# Altium project RSSI_Tag.PrjPcb
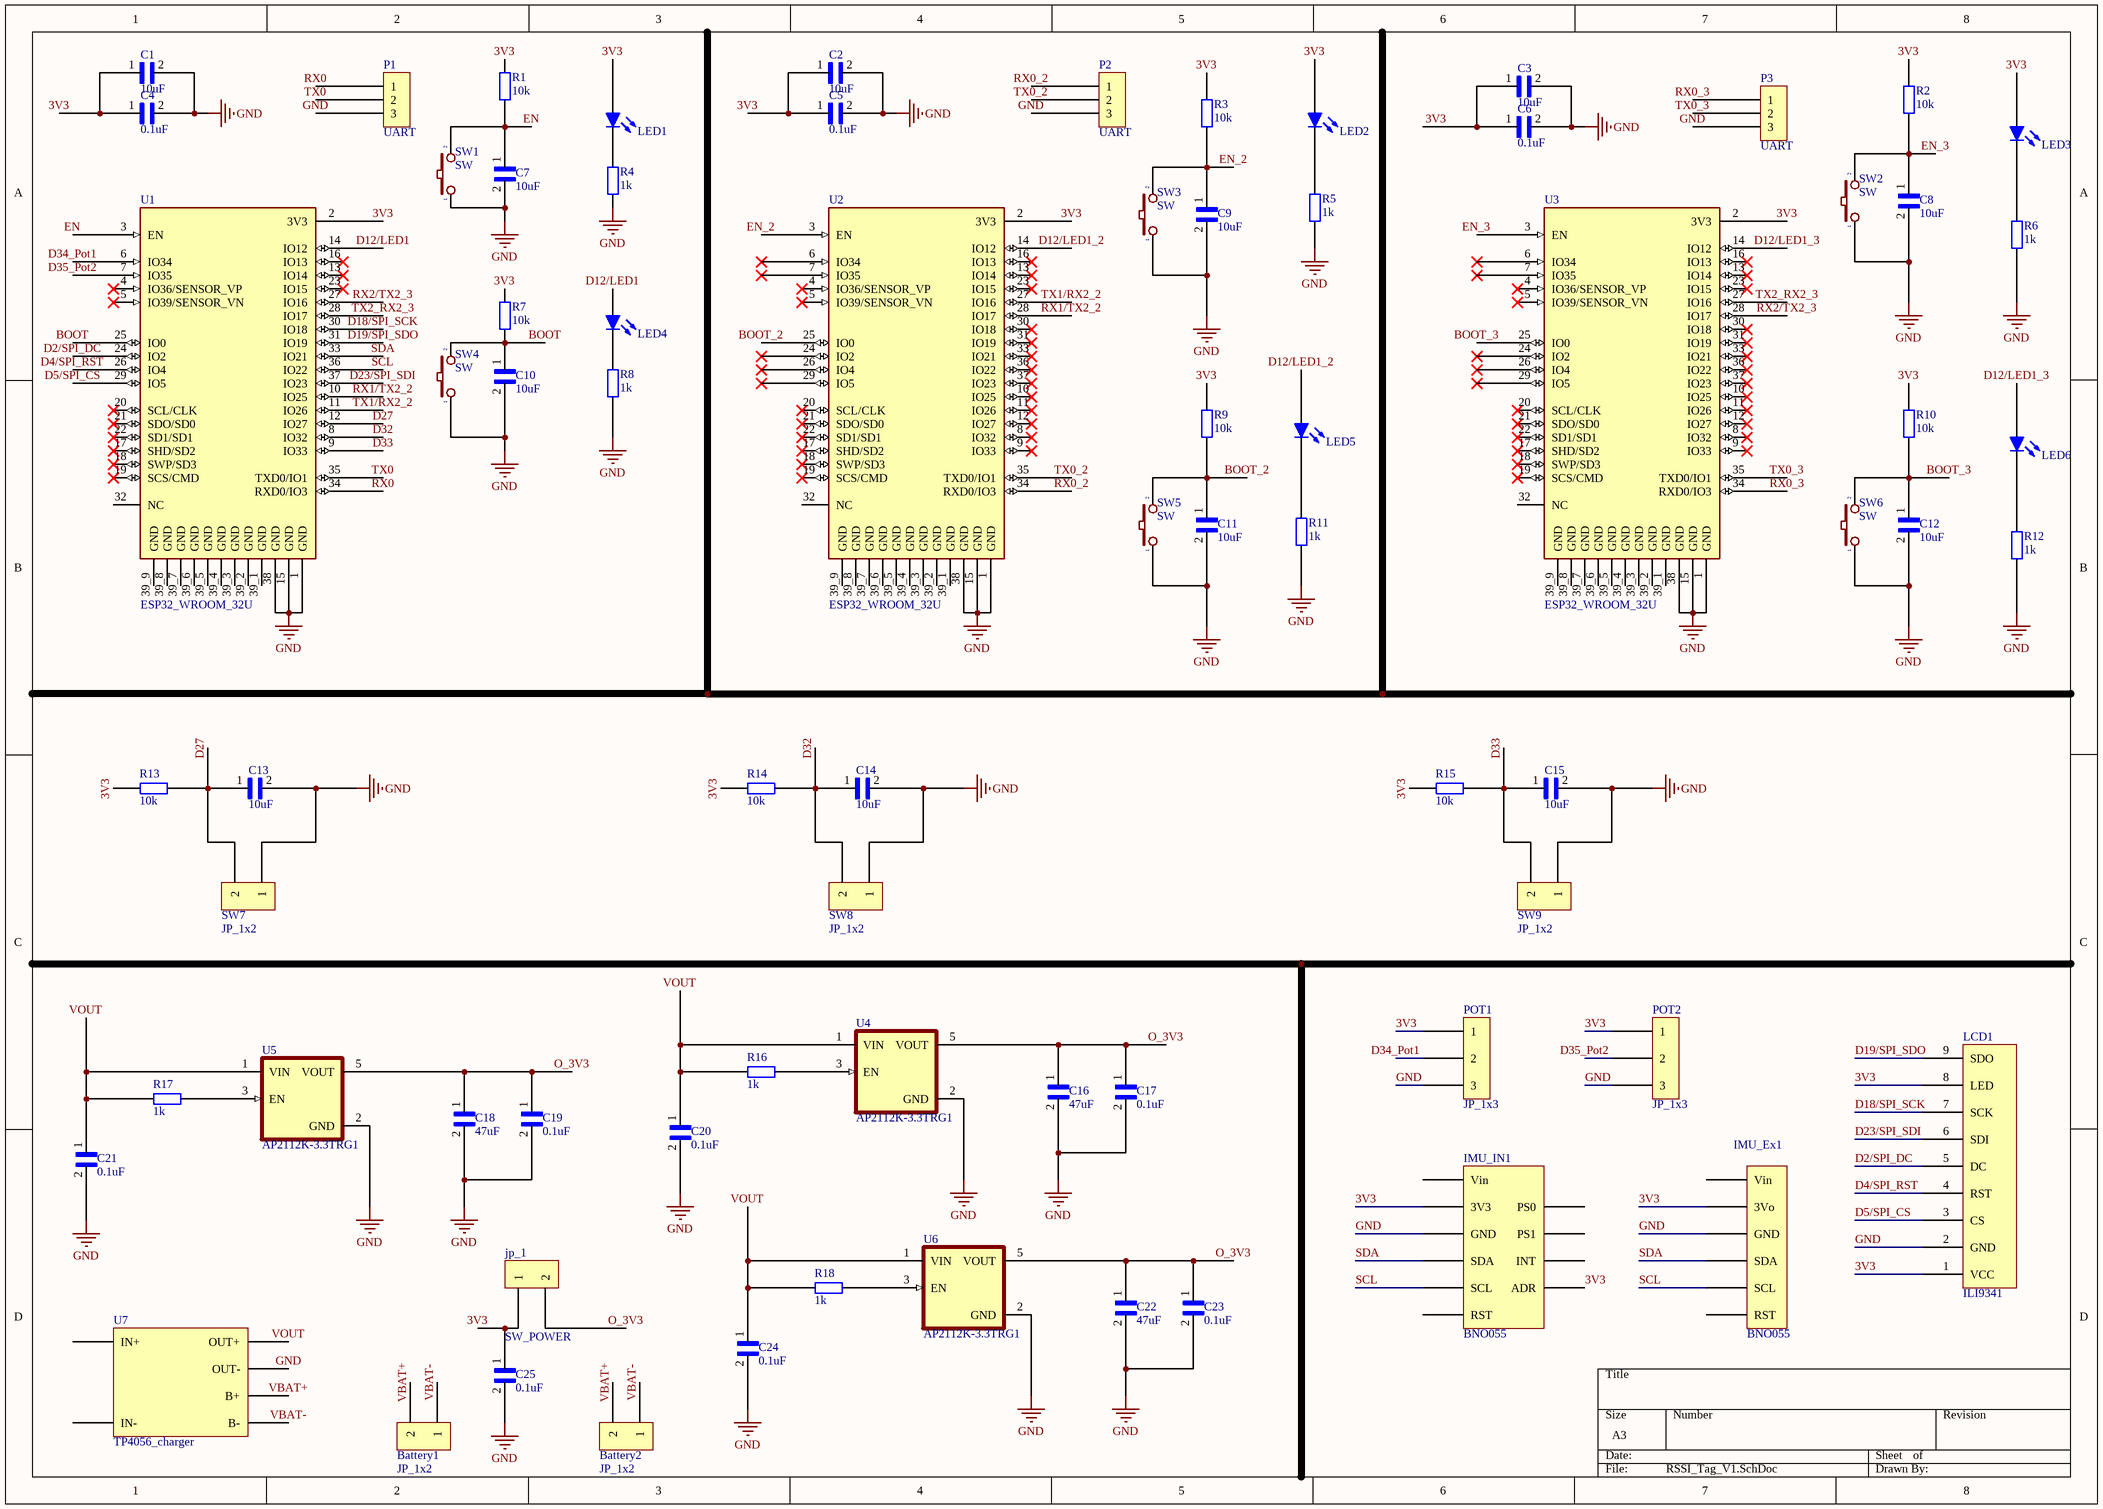
[diagram p0: RSSI_Tag_V1.SchDoc]
1 sheet, 76 parts. Net scope: global (net labels, ports and power ports of the same name join across sheets).
Board file: RSSI_Tag_V1.PcbDoc

## Sheet RSSI_Tag_V1.SchDoc
size A3; SheetNumber: 1; SheetTotal: 1

### Parts
Battery1  JP_1x2  [JP_1x2]
Battery2  JP_1x2  [JP_1x2]
C1  10uF  [Capacitor_0805]
C2  10uF  [Capacitor_0805]
C3  10uF  [Capacitor_0805]
C4  0.1uF  [Capacitor_0805]
C5  0.1uF  [Capacitor_0805]
C6  0.1uF  [Capacitor_0805]
C7  10uF  [Capacitor_0805]
C8  10uF  [Capacitor_0805]
C9  10uF  [Capacitor_0805]
C10  10uF  [Capacitor_0805]
C11  10uF  [Capacitor_0805]
C12  10uF  [Capacitor_0805]
C13  10uF  [Capacitor_0805]
C14  10uF  [Capacitor_0805]
C15  10uF  [Capacitor_0805]
C16  47uF  [Capacitor_0805]
C17  0.1uF  [Capacitor_0805]
C18  47uF  [Capacitor_0805]
C19  0.1uF  [Capacitor_0805]
C20  0.1uF  [Capacitor_0805]
C21  0.1uF  [Capacitor_0805]
C22  47uF  [Capacitor_0805]
C23  0.1uF  [Capacitor_0805]
C24  0.1uF  [Capacitor_0805]
C25  0.1uF  [Capacitor_0805]
IMU_Ex1  BNO055  [BNO055_External]
IMU_IN1  BNO055  [BNO055_Internal]
jp_1  SW_POWER  [JP_1x2]
LCD1  ILI9341  [ILI9341_LCD3.5]
LED1  Led  [Led 0805 Blue]  (value not drawn)
LED2  Led  [Led 0805 Blue]  (value not drawn)
LED3  Led  [Led 0805 Blue]  (value not drawn)
LED4  Led  [Led 0805 Blue]  (value not drawn)
LED5  Led  [Led 0805 Blue]  (value not drawn)
LED6  Led  [Led 0805 Blue]  (value not drawn)
P1  UART  [HDR/Header/3/BOX]
P2  UART  [HDR/Header/3/BOX]
P3  UART  [HDR/Header/3/BOX]
POT1  JP_1x3  [JP_1x3]
POT2  JP_1x3  [JP_1x3]
R1  10k  [tro smd 0805]
R2  10k  [tro smd 0805]
R3  10k  [tro smd 0805]
R4  1k  [tro smd 0805]
R5  1k  [tro smd 0805]
R6  1k  [tro smd 0805]
R7  10k  [tro smd 0805]
R8  1k  [tro smd 0805]
R9  10k  [tro smd 0805]
R10  10k  [tro smd 0805]
R11  1k  [tro smd 0805]
R12  1k  [tro smd 0805]
R13  10k  [tro smd 0805]
R14  10k  [tro smd 0805]
R15  10k  [tro smd 0805]
R16  1k  [tro smd 0805]
R17  1k  [tro smd 0805]
R18  1k  [tro smd 0805]
SW1  SW  [SW1-SMD]
SW2  SW  [SW1-SMD]
SW3  SW  [SW1-SMD]
SW4  SW  [SW1-SMD]
SW5  SW  [SW1-SMD]
SW6  SW  [SW1-SMD]
SW7  JP_1x2  [JP_1x2]
SW8  JP_1x2  [JP_1x2]
SW9  JP_1x2  [JP_1x2]
U1  ESP32_WROOM_32U  [ESP32_WROOM_32U]
U2  ESP32_WROOM_32U  [ESP32_WROOM_32U]
U3  ESP32_WROOM_32U  [ESP32_WROOM_32U]
U4  AP2112K-3.3TRG1  [SOT95P285X140-5N]
U5  AP2112K-3.3TRG1  [SOT95P285X140-5N]
U6  AP2112K-3.3TRG1  [SOT95P285X140-5N]
U7  TP4056_charger  [TP4056_charger]

### Nets
GND: C1.2 C2.2 C3.2 C4.2 C5.2 C6.2 C7.2 C8.2 C9.2 C10.2 C11.2 C12.2 C13.2 C14.2 C15.2 C16.2 C17.2 C18.2 C19.2 C20.2 C21.2 C22.2 C23.2 C24.2 C25.2 IMU_Ex1.3(GND) IMU_IN1.3(GND) LCD1.2(GND) P1.3 P2.3 P3.3 POT1.3 POT2.3 R4.2 R5.2 R6.2 R8.2 R11.2 R12.2 SW1.1 SW2.1 SW3.1 SW4.1 SW5.1 SW6.1 SW7.1 SW8.1 SW9.1 U1.1(GND) U1.15(GND) U1.38(GND) U2.1(GND) U2.15(GND) U2.38(GND) U3.1(GND) U3.15(GND) U3.38(GND) U4.2(GND) U5.2(GND) U6.2(GND) U7.4(OUT-)
3V3: C1.1 C2.1 C3.1 C4.1 C5.1 C6.1 C25.1 IMU_Ex1.2(3Vo) IMU_IN1.2(3V3) IMU_IN1.7(ADR) jp_1.1 LCD1.1(VCC) LCD1.8(LED) LED1.1(A) LED2.1(A) LED3.1(A) POT1.1 POT2.1 R1.2 R2.2 R3.2 R7.2 R9.2 R10.2 R13.2 R14.2 R15.2 U1.2(3V3) U2.2(3V3) U3.2(3V3)
BOOT: C10.1 R7.1 SW4.2 U1.25(IO0)
BOOT_2: C11.1 R9.1 SW5.2 U2.25(IO0)
BOOT_3: C12.1 R10.1 SW6.2 U3.25(IO0)
D2/SPI_DC: LCD1.5(DC) U1.24(IO2)
D4/SPI_RST: LCD1.4(RST) U1.26(IO4)
D5/SPI_CS: LCD1.3(CS) U1.29(IO5)
D12/LED1: LED4.1(A) U1.14(IO12)
D12/LED1_2: LED5.1(A) U2.14(IO12)
D12/LED1_3: LED6.1(A) U3.14(IO12)
D18/SPI_SCK: LCD1.7(SCK) U1.30(IO18)
D19/SPI_SDO: LCD1.9(SDO) U1.31(IO19)
D23/SPI_SDI: LCD1.6(SDI) U1.37(IO23)
D27: C13.1 R13.1 SW7.2 U1.12(IO27)
D32: C14.1 R14.1 SW8.2 U1.8(IO32)
D33: C15.1 R15.1 SW9.2 U1.9(IO33)
D34_Pot1: POT1.2 U1.6(IO34)
D35_Pot2: POT2.2 U1.7(IO35)
EN: C7.1 R1.1 SW1.2 U1.3(EN)
EN_2: C9.1 R3.1 SW3.2 U2.3(EN)
EN_3: C8.1 R2.1 SW2.2 U3.3(EN)
O_3V3: C16.1 C17.1 C18.1 C19.1 C22.1 C23.1 jp_1.2 U4.5(VOUT) U5.5(VOUT) U6.5(VOUT)
RX0: P1.1 U1.34(RXD0/IO3)
RX0_2: P2.1 U2.34(RXD0/IO3)
RX0_3: P3.1 U3.34(RXD0/IO3)
RX1/TX2_2: U1.10(IO25) U2.28(IO17)
RX2/TX2_3: U1.27(IO16) U3.28(IO17)
SCL: IMU_Ex1.5(SCL) IMU_IN1.5(SCL) U1.36(IO22)
SDA: IMU_Ex1.4(SDA) IMU_IN1.4(SDA) U1.33(IO21)
TX0: P1.2 U1.35(TXD0/IO1)
TX0_2: P2.2 U2.35(TXD0/IO1)
TX0_3: P3.2 U3.35(TXD0/IO1)
TX1/RX2_2: U1.11(IO26) U2.27(IO16)
TX2_RX2_3: U1.28(IO17) U3.27(IO16)
VBAT+: Battery1.2 Battery2.2 U7.1(B+)
VBAT-: Battery1.1 Battery2.1 U7.2(B-)
VOUT: C20.1 C21.1 C24.1 R16.1 R17.1 R18.1 U4.1(VIN) U5.1(VIN) U6.1(VIN) U7.3(OUT+)
NetLED1_2: LED1.2(K) R4.1
NetLED2_2: LED2.2(K) R5.1
NetLED3_2: LED3.2(K) R6.1
NetLED4_2: LED4.2(K) R8.1
NetLED5_2: LED5.2(K) R11.1
NetLED6_2: LED6.2(K) R12.1
NetR16_2: R16.2 U4.3(EN)
NetR17_2: R17.2 U5.3(EN)
NetR18_2: R18.2 U6.3(EN)

Not connected (* = marked no-connect by the designer): IMU_Ex1 1(Vin) 6(RST); IMU_IN1 1(Vin) 6(RST) 8(INT) 9(PS1) 10(PS0); U1 4(IO36/SENSOR_VP)* 5(IO39/SENSOR_VN)* 13(IO14)* 16(IO13)* 17(SHD/SD2)* 18(SWP/SD3)* 19(SCS/CMD)* 20(SCL/CLK)* 21(SDO/SD0)* 22(SD1/SD1)* 23(IO15)* 32(NC) 39_1(GND) 39_2(GND) 39_3(GND) 39_4(GND) 39_5(GND) 39_6(GND) 39_7(GND) 39_8(GND) 39_9(GND); U2 4(IO36/SENSOR_VP)* 5(IO39/SENSOR_VN)* 6(IO34)* 7(IO35)* 8(IO32)* 9(IO33)* 10(IO25)* 11(IO26)* 12(IO27)* 13(IO14)* 16(IO13)* 17(SHD/SD2)* 18(SWP/SD3)* 19(SCS/CMD)* 20(SCL/CLK)* 21(SDO/SD0)* 22(SD1/SD1)* 23(IO15)* 24(IO2)* 26(IO4)* 29(IO5)* 30(IO18)* 31(IO19)* 32(NC) 33(IO21)* 36(IO22)* 37(IO23)* 39_1(GND) 39_2(GND) 39_3(GND) 39_4(GND) 39_5(GND) 39_6(GND) 39_7(GND) 39_8(GND) 39_9(GND); U3 4(IO36/SENSOR_VP)* 5(IO39/SENSOR_VN)* 6(IO34)* 7(IO35)* 8(IO32)* 9(IO33)* 10(IO25)* 11(IO26)* 12(IO27)* 13(IO14)* 16(IO13)* 17(SHD/SD2)* 18(SWP/SD3)* 19(SCS/CMD)* 20(SCL/CLK)* 21(SDO/SD0)* 22(SD1/SD1)* 23(IO15)* 24(IO2)* 26(IO4)* 29(IO5)* 30(IO18)* 31(IO19)* 32(NC) 33(IO21)* 36(IO22)* 37(IO23)* 39_1(GND) 39_2(GND) 39_3(GND) 39_4(GND) 39_5(GND) 39_6(GND) 39_7(GND) 39_8(GND) 39_9(GND); U7 5(IN+) 6(IN-)

### Library data of the parts
C1-C25 = Capacitor_0805: Capacitor; Ceramic; Cap; .220uF; Tol 10%; SMT; Vol-Rtg 50V; X7R; Tape And Reel
IMU_Ex1 = BNO055_External
jp_1 = JP_1x2
LCD1 = ILI9341_LCD3.5
LED1-LED6 = Led: Typical LED
P1-P3 = Header 3: Header, 3-Pin
R1-R3 R7 R9 R10 R13-R15 = Tro 0805 1% 10k: Dán; Don_Vi: Con; So_Chan: 2; Ten_Linh_Kien: Trở 0805 1% 10k; Ma_Hang: MH005473; Chung_Loai: Dán; Kieu_Chan: *
R4-R6 R8 R11 R12 R16-R18 = Tro 0805 1% 1k: Dán; Don_Vi: Con; So_Chan: 2; Ten_Linh_Kien: Trở 0805 1% 1k; Ma_Hang: MH005468; Chung_Loai: Dán; Kieu_Chan: *
SW1-SW6 = SW2: Switch button 2 pin; Value: SW chip 2 pin
U1-U3 = ESP32_WROOM_32U: Bluetooth, WiFi 802.11b/g/n, Bluetooth v4.2 +EDR, Class 1, 2 and 3 Transceiver Module 2.4GHz ~ 2.5GHz Antenna Not Included, U.FL Surface Mount
U4-U6 = AP2112K-3.3TRG1: Linear Voltage Regulator IC Positive Fixed 1 Output 600mA SOT-25; MF: Diodes Inc.; Value: *; Purchase-URL: https://pricing.snapeda.com/search/part/AP2112K-3.3TRG1/?ref=eda; Package: SOT-753 Diodes Inc.; Availability: In Stock; Check_prices: https://www.snapeda.com/parts/AP2112K-3.3TRG1/Diodes+Inc./view-part/?ref=eda; Price: None; SnapEDA_Link: https://www.snapeda.com/parts/AP2112K-3.3TRG1/Diodes+Inc./view-part/?ref=snap; MP: AP2112K-3.3TRG1